# Altium schematic sheet WRTnode.SchDoc
size A4
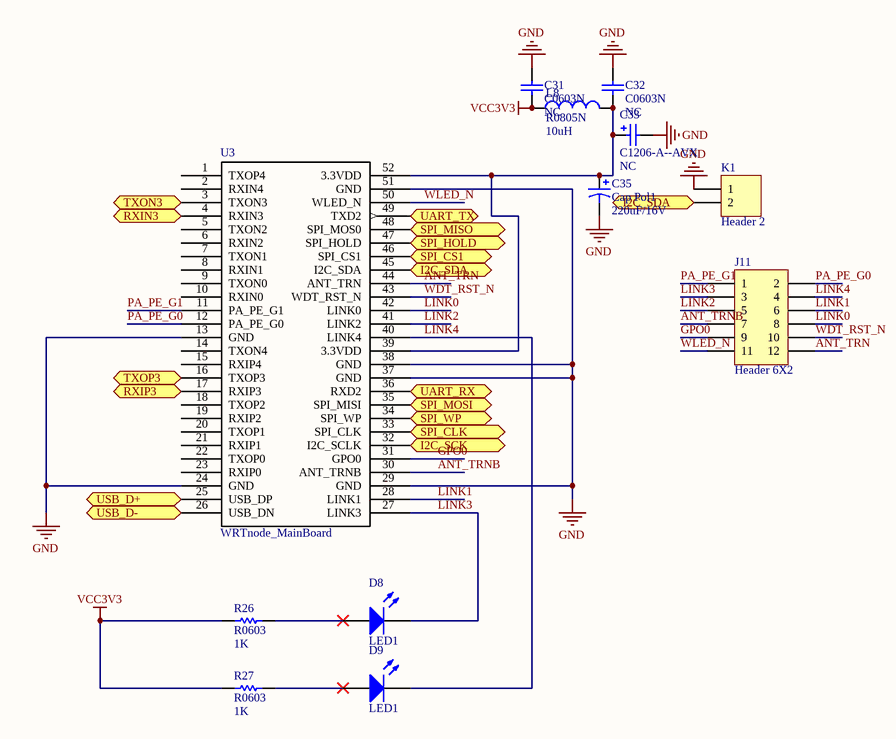
[diagram p0: WRTnode.SchDoc]

## Parts
C31  C0603N  value NC  [C0603N]
C32  C0603N  value NC  [C0603N]
C33  C1206-A--AVX  value NC  [C1206-A]
C35  Cap Pol1  value 220uF/16V  [16V220U]
D8  LED1  [LED0603]
D9  LED1  [LED0603]
J11  Header 6X2  [HDR2X6]
K1  Header 2  [3*6key]
L8  R0805N  value 10uH  [R0805N]
R26  R0603  value 1K  [R0603N]
R27  R0603  value 1K  [R0603N]
U3  WRTnode_MainBoard  [WRTnode_MainBoard_DIP26*2]

## Ports
I2C_SCK (bidir), I2C_SDA, I2C_SDA (bidir), RXIN3 (in), RXIP3 (in), SPI_CLK (bidir), SPI_CS1 (out), SPI_HOLD (out), SPI_MISO (in), SPI_MOSI (out), SPI_WP (out), TXON3 (out), TXOP3 (out), UART_RX (in), UART_TX (out), USB_D+ (bidir), USB_D- (bidir)

## Nets
GND: C31.2 C32.2 C33.2 C35.2 K1.1 U3.13(GND) U3.24(GND) U3.29(GND) U3.37(GND) U3.38(GND) U3.51(GND)
VCC3V3: C31.1 L8.1 R26.1 R27.1
ANT_TRN: J11.12 U3.44(ANT_TRN)
ANT_TRNB: J11.7 U3.30(ANT_TRNB)
GPO0: J11.9 U3.31(GPO0)
I2C_SCK: U3.32(I2C_SCLK) ; port I2C_SCK
I2C_SDA: K1.2 U3.45(I2C_SDA) ; port I2C_SDA
LINK0: J11.8 U3.42(LINK0)
LINK1: J11.6 U3.28(LINK1)
LINK2: J11.5 U3.41(LINK2)
LINK3: D8.2(K) J11.3 U3.27(LINK3)
LINK4: D9.2(K) J11.4 U3.40(LINK4)
PA_PE_G0: J11.2 U3.12(PA_PE_G0)
PA_PE_G1: J11.1 U3.11(PA_PE_G1)
RXIN3: U3.4(RXIN3) ; port RXIN3
RXIP3: U3.17(RXIP3) ; port RXIP3
SPI_CLK: U3.33(SPI_CLK) ; port SPI_CLK
SPI_CS1: U3.46(SPI_CS1) ; port SPI_CS1
SPI_HOLD: U3.47(SPI_HOLD) ; port SPI_HOLD
SPI_MISO: U3.48(SPI_MOS0) ; port SPI_MISO
SPI_MOSI: U3.35(SPI_MISI) ; port SPI_MOSI
SPI_WP: U3.34(SPI_WP) ; port SPI_WP
TXON3: U3.3(TXON3) ; port TXON3
TXOP3: U3.16(TXOP3) ; port TXOP3
UART_RX: U3.36(RXD2) ; port UART_RX
UART_TX: U3.49(TXD2) ; port UART_TX
USB_D+: U3.25(USB_DP) ; port USB_D+
USB_D-: U3.26(USB_DN) ; port USB_D-
WDT_RST_N: J11.10 U3.43(WDT_RST_N)
WLED_N: J11.11 U3.50(WLED_N)
NetC32_1: C32.1 C33.1 C35.1 L8.2 U3.39(3.3VDD) U3.52(3.3VDD)
NetD8_1: D8.1(A) R26.2
NetD9_1: D9.1(A) R27.2

Not connected (* = marked no-connect by the designer): U3 1(TXOP4) 2(RXIN4) 5(TXON2) 6(RXIN2) 7(TXON1) 8(RXIN1) 9(TXON0) 10(RXIN0) 14(TXON4) 15(RXIP4) 18(TXOP2) 19(RXIP2) 20(TXOP1) 21(RXIP1) 22(TXOP0) 23(RXIP0)

## Library data of the parts
C31 C32 = Cap: Capacitor; Published: 8-Jun-2000; LatestRevisionDate: 17-Jul-2002; LatestRevisionNote: Re-released for DXP Platform.; PackageReference: RAD-0.3; Publisher: Altium Limited
C33 = Cap Pol3: Polarized Capacitor (Surface Mount)
C35 = Cap Pol1: Polarized Capacitor (Radial); Published: 8-Jun-2000; LatestRevisionDate: 17-Jul-2002; LatestRevisionNote: Re-released for DXP Platform.; PackageReference: RB7.6-15; Publisher: Altium Limited
D8 D9 = LED1: Typical RED GaAs LED; Published: 8-Jun-2000; LatestRevisionDate: 08-Jul-2005; LatestRevisionNote: Mech Layer 1 removed.; PackageReference: LED-1; Publisher: Altium Limited
J11 = Header 6X2: Header, 6-Pin, Dual row; LatestRevisionDate: 17-Jul-2002; LatestRevisionNote: Re-released for DXP Platform.; Publisher: Altium Limited
K1 = Header 2: Header, 2-Pin; LatestRevisionDate: 17-Jul-2002; LatestRevisionNote: Re-released for DXP Platform.; Publisher: Altium Limited
L8 = Inductor
R26 R27 = Res Semi: Semiconductor Resistor